# Altium schematic sheet Alarm_clock_Schemetic.schdoc
size 295 x 214 mm; SheetNumber: 1; SheetTotal: 1
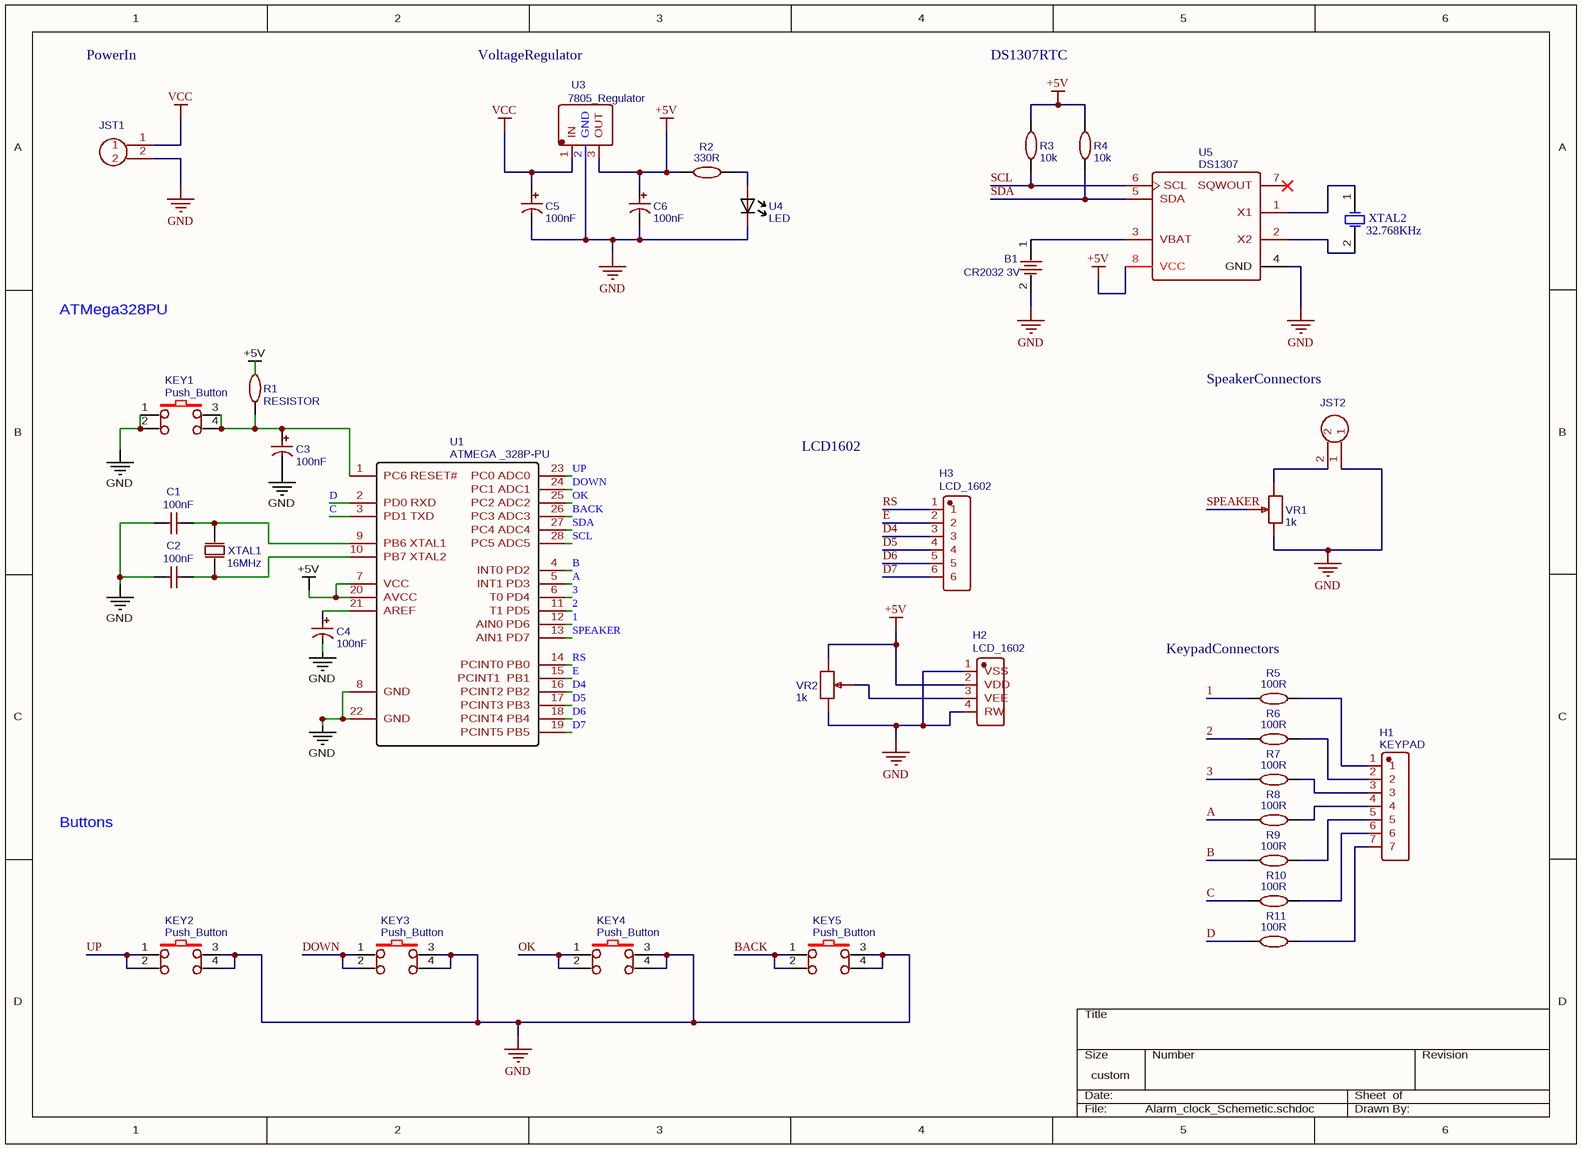
[diagram p0: Alarm_clock_Schemetic.schdoc]

## Parts
B1  CR2032 3V  [BAT-TH_BS-2-1]
C1  100nF  [RAD-0.2]
C2  100nF  [RAD-0.2]
C3  100nF  [CAP-TH_BD5.0-P2.00-D0.8-FD]
C4  100nF  [CAP-TH_BD5.0-P2.00-D0.8-FD]
C5  100nF  [CAP-TH_BD5.0-P2.00-D0.8-FD]
C6  100nF  [CAP-TH_BD5.0-P2.00-D0.8-FD]
H1  KEYPAD  [HDR-TH_7P-P1.27-V-M]
H2  LCD_1602  [HDR-TH_4P-P2.00-V-M]
H3  LCD_1602  [HDR-TH_6P-P2.54-H-F-W5.7]
JST1  JST_2 PIN  [CONN-TH_XHB-2A]  (value not drawn)
JST2  JST_2 PIN  [CONN-TH_XHB-2A]  (value not drawn)
KEY1  Push_Button  [KEY-TH_4P-L6.0-W6.0-P4.50]
KEY2  Push_Button  [KEY-TH_4P-L6.0-W6.0-P4.50]
KEY3  Push_Button  [KEY-TH_4P-L6.0-W6.0-P4.50]
KEY4  Push_Button  [KEY-TH_4P-L6.0-W6.0-P4.50]
KEY5  Push_Button  [KEY-TH_4P-L6.0-W6.0-P4.50]
R1  RESISTOR  [AXIAL-0.4]
R2  330R  [AXIAL-0.4]
R3  10k  [AXIAL-0.4]
R4  10k  [AXIAL-0.4]
R5  100R  [AXIAL-0.4]
R6  100R  [AXIAL-0.4]
R7  100R  [AXIAL-0.4]
R8  100R  [AXIAL-0.4]
R9  100R  [AXIAL-0.4]
R10  100R  [AXIAL-0.4]
R11  100R  [AXIAL-0.4]
U1  ATMEGA _328P-PU  [DIP-28_L34.6-W7.3-P2.54-LS10.2-BL]
U3  7805_Regulator  [TO-220-3_L10.0-W4.5-P2.54-L]
U4  LED  [5MM LED]
U5  DS1307  [DIP-8_L9.8-W6.6-P2.54-LS7.6-BL]
VR1  1k  [RES-ADJ-TH_3296W]
VR2  1k  [RES-ADJ-TH_3296W]
XTAL1  16MHz  [16MHZ_OSC [PCB]]
XTAL2  32.768KHz  [R38]

## Nets
+5V: C6.1 H2.2(VDD) R1.2 R2.1 R3.2 R4.2 U1.7(VCC) U1.20(AVCC) U3.3(OUT) U5.8(VCC) VR2.3
GND: B1.2 C1.1 C2.1 C3.2 C4.2 C5.2 C6.2 H2.1(VSS) H2.4(RW) JST1.2 JST2.1 KEY1.1 KEY1.2 KEY2.3 KEY2.4 KEY3.3 KEY3.4 KEY4.3 KEY4.4 KEY5.3 KEY5.4 U1.8(GND) U1.22(GND) U3.2(GND) U4.2 U5.4(GND) VR1.3 VR2.1
VCC: C5.1 JST1.1 U3.1(IN)
1: R5.1 U1.12(AIN0_PD6)
2: R6.1 U1.11(T1_PD5)
3: R7.1 U1.6(T0_PD4)
A: R8.1 U1.5(INT1_PD3)
B: R9.1 U1.4(INT0_PD2)
BACK: KEY5.1 KEY5.2 U1.26(PC3_ADC3)
C: R10.1 U1.3(PD1_TXD)
D: R11.1 U1.2(PD0_RXD)
D4: H3.3 U1.16(PCINT2_PB2)
D5: H3.4 U1.17(PCINT3_PB3)
D6: H3.5 U1.18(PCINT4_PB4)
D7: H3.6 U1.19(PCINT5_PB5)
DOWN: KEY3.1 KEY3.2 U1.24(PC1_ADC1)
E: H3.2 U1.15(PCINT1__PB1)
OK: KEY4.1 KEY4.2 U1.25(PC2_ADC2)
RS: H3.1 U1.14(PCINT0_PB0)
SCL: R3.1 U1.28(PC5_ADC5) U5.6(SCL)
SDA: R4.1 U1.27(PC4_ADC4) U5.5(SDA)
SPEAKER: U1.13(AIN1_PD7) VR1.2
UP: KEY2.1 KEY2.2 U1.23(PC0_ADC0)
NetB1_1: B1.1 U5.3(VBAT)
NetC1_2: C1.2 U1.9(PB6_XTAL1) XTAL1.1(OSC1)
NetC2_2: C2.2 U1.10(PB7_XTAL2) XTAL1.2(OSC2)
NetC3_1: C3.1 KEY1.3 KEY1.4 R1.1 U1.1(PC6_RESET#)
NetC4_1: C4.1 U1.21(AREF)
NetH1_1: H1.1 R5.2
NetH1_2: H1.2 R6.2
NetH1_3: H1.3 R7.2
NetH1_4: H1.4 R8.2
NetH1_5: H1.5 R9.2
NetH1_6: H1.6 R10.2
NetH1_7: H1.7 R11.2
NetH2_3: H2.3(VEE) VR2.2
NetJST2_2: JST2.2 VR1.1
NetR2_2: R2.2 U4.1
NetU5_1: U5.1(X1) XTAL2.1(OSC1)
NetU5_2: U5.2(X2) XTAL2.2(OSC2)

Not connected (* = marked no-connect by the designer): U5 7(SQWOUT)*

## Notes on the sheet
- PowerIn
- VoltageRegulator
- DS1307RTC
- ATMega328PU
- SpeakerConnectors
- LCD1602
- (near R5) KeypadConnectors
- Buttons

## Library data of the parts
B1 = CR2032 3V: BOM_Manufacturer: Q&J; BOM_Manufacturer Part: BS-2-1; BOM_Supplier: LCSC; BOM_Supplier Part: C70376; BOM_JLCPCB Part Class: Extended Part; spicePre: B; spiceSymbolName: CR2032-BS-2-1
C1 C2 = 100nF: BOM_Manufacturer: LCSC; BOM_Manufacturer Part: 0.1UF(104) +-20% 63v; Value: 100nF; BOM_Supplier: LCSC; BOM_Supplier Part: C19355; spicePre: C; spiceSymbolName: 100nF
C3-C6 = 100nF: BOM_Manufacturer: ValuePro; BOM_Manufacturer Part: 0.1UF 50V; nameAlias: Capacitance; BOM_Supplier: LCSC; BOM_Supplier Part: C28061; BOM_JLCPCB Part Class: Extended Part; spicePre: C; spiceSymbolName: 0.1uF
H1 = KEYPAD: BOM_Manufacturer: XFCN(台湾兴飞); BOM_Manufacturer Part: PZ127V-11-07-H25; Contributor: LCSC; BOM_Supplier: LCSC; BOM_Supplier Part: C2832274; spicePre: H; spiceSymbolName: PZ127V-11-07-H25
H2 = LCD_1602: BOM_Manufacturer: XFCN(台湾兴飞); BOM_Manufacturer Part: MH200V-11-04-1000; Contributor: LCSC; BOM_Supplier: LCSC; BOM_Supplier Part: C2839989; spicePre: H; spiceSymbolName: MH200V-11-04-1000
H3 = LCD_1602: BOM_Manufacturer: TXGA(特思嘉); BOM_Manufacturer Part: FFH25402-S06B1001K6K; Contributor: LCSC; BOM_Supplier: LCSC; BOM_Supplier Part: C2833720; spicePre: H; spiceSymbolName: FFH25402-S06B1001K6K
JST1 JST2 = JST_2 PIN: BOM_Manufacturer: BOOMELE; BOM_Manufacturer Part: XHB-2A Connector; BOM_Supplier: LCSC; image: //image.lceda.cn/szlcsc/C57981.jpg; BOM_Supplier Part: C57981; BOM_JLCPCB Part Class: Extended Part; spicePre: C; spiceSymbolName: JST_2 PIN
KEY1-KEY5 = Push_Button: BOM_Manufacturer: ReliaPro; BOM_Manufacturer Part: button6*6*8.5; BOM_Supplier Part: C59980; BOM_Supplier: LCSC; image: http://image.lceda.cn/szlcsc/C59980.jpg; spicePre: K; spiceSymbolName: Push_Button
R1 = RESISTOR: BOM_Manufacturer: UniOhm; BOM_Manufacturer Part: MFR0W4F2200A50; Power: 1/4W; Tolerance: ±1%; BOM_EasyEDA: E57439; Value: Value; BOM_Supplier Part: E57439; BOM_Supplier: EasyEDA; spicePre: R; spiceSymbolName: RESISTOR
R2 = 330R: BOM_Manufacturer: UniOhm; BOM_Manufacturer Part: MFR0W4F2200A50; Power: 1/4W; Tolerance: ±1%; BOM_EasyEDA: E57439; Value: Value; BOM_Supplier Part: E57439; BOM_Supplier: EasyEDA; spicePre: R; spiceSymbolName: RESISTOR
R3 R4 = 10k: BOM_Manufacturer: UniOhm; BOM_Manufacturer Part: MFR0W4F2200A50; Power: 1/4W; Tolerance: ±1%; BOM_EasyEDA: E57439; Value: Value; BOM_Supplier Part: E57439; BOM_Supplier: EasyEDA; spicePre: R; spiceSymbolName: RESISTOR
R5-R11 = 100R: BOM_Manufacturer: UniOhm; BOM_Manufacturer Part: MFR0W4F2200A50; Power: 1/4W; Tolerance: ±1%; BOM_EasyEDA: E57439; Value: Value; BOM_Supplier Part: E57439; BOM_Supplier: EasyEDA; spicePre: R; spiceSymbolName: RESISTOR
U1 = ATMEGA _328P-PU: BOM_Manufacturer: MICROCHIP; BOM_Manufacturer Part: ATMEGA328P-PU; sourceId: Oic6oiASL; Contributor: LCSC; timeStamp: 1451725987; BOM_Supplier: LCSC; image: //image.lceda.cn/szlcsc/C33901.jpg; BOM_Supplier Part: C33901; spicePre: U; spiceSymbolName: ATMEGA _328P-PU
U3 = 7805_Regulator: BOM_Manufacturer: Foshan Blue Rocket Elec; BOM_Manufacturer Part: 7805; Contributor: LCSC; BOM_Supplier: LCSC; BOM_Supplier Part: C305416; BOM_JLCPCB Part Class: Extended Part; spicePre: U; spiceSymbolName: 7805_Regulator
U4 = LED: Contributor: Axbri; BOM_Manufacturer Part: 5mm LED; spicePre: U; spiceSymbolName: LED
U5 = DS1307: BOM_Manufacturer: MAXIM; BOM_Manufacturer Part: DS1307+; BOM_Supplier: LCSC; BOM_Supplier Part: C59267; BOM_JLCPCB Part Class: Extended Part; spicePre: U; spiceSymbolName: DS1307+
VR1 VR2 = 1k: BOM_Manufacturer: ReliaPro; BOM_Manufacturer Part: Pot-100R; nameAlias: Resistance(Ohms); BOM_Supplier: LCSC; BOM_Supplier Part: C13649; spicePre: V; spiceSymbolName: Pot-100R
XTAL1 = 16MHz: BOM_Manufacturer: SHIVRAM; BOM_Manufacturer Part: 0SC-16MHz; nameAlias: Frequency; Contributor: Mantas Petrauskas; BOM_Supplier: SHIVRAM; BOM_Supplier Part: 0SC-16MHz; spicePre: X; spiceSymbolName: Crystal Oscillator
XTAL2 = XTAL: Crystal Oscillator; Published: 8-Jun-2000; LatestRevisionDate: 17-Jul-2002; LatestRevisionNote: Re-released for DXP Platform.; PackageReference: R38; Publisher: Altium Limited; PackageDescription: Crystal, Thru-Hole; 2 Leads; Body 3.1 x 8.2 mm (Dia.xH)